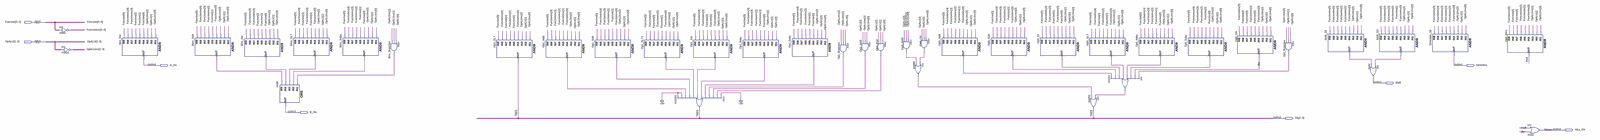
[diagram p0: schematic sheet, whole]
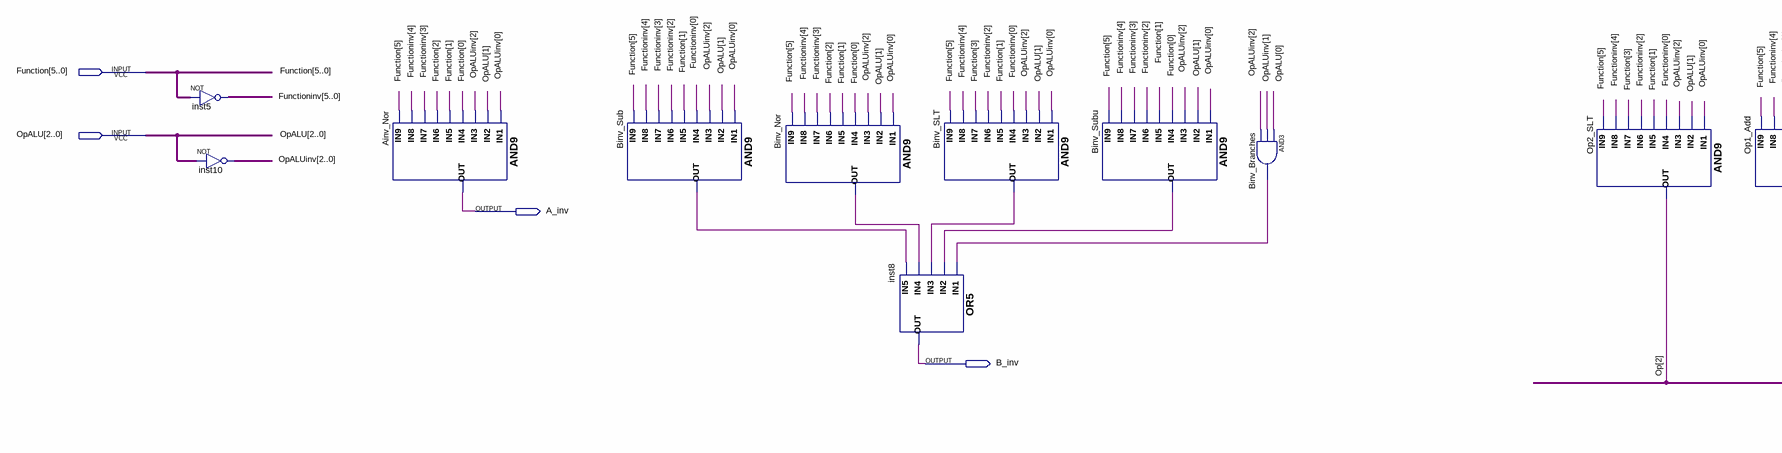
[diagram p1: schematic sheet, left part]
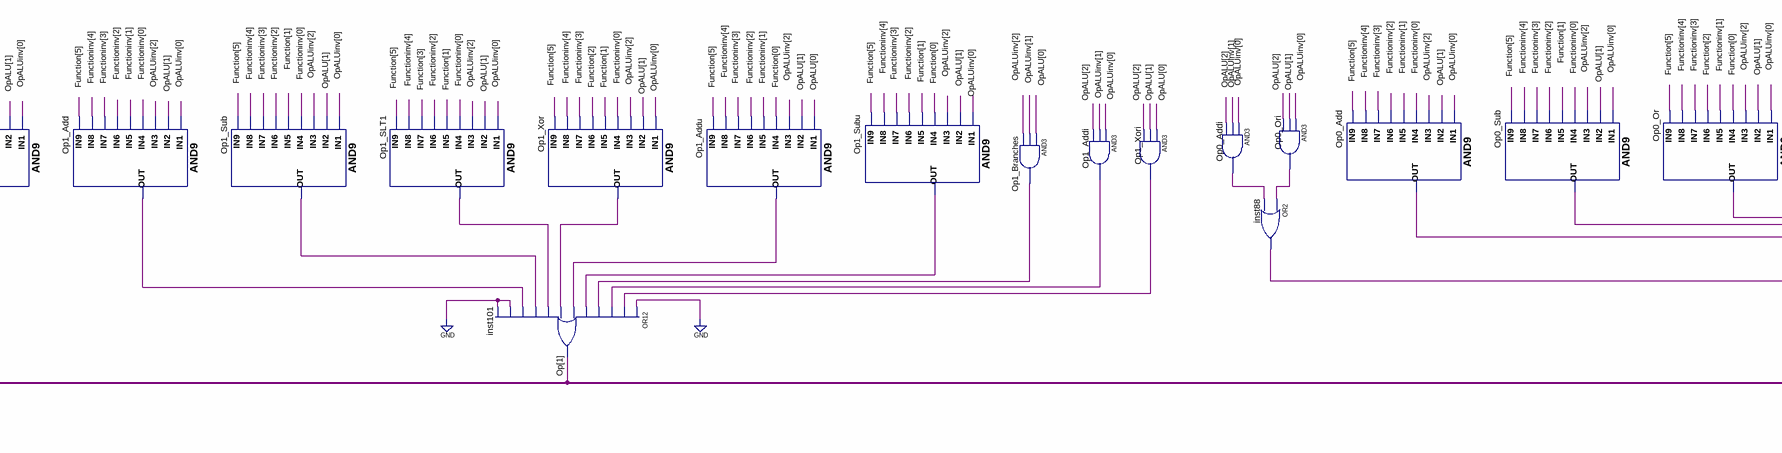
[diagram p2: schematic sheet, centre part]
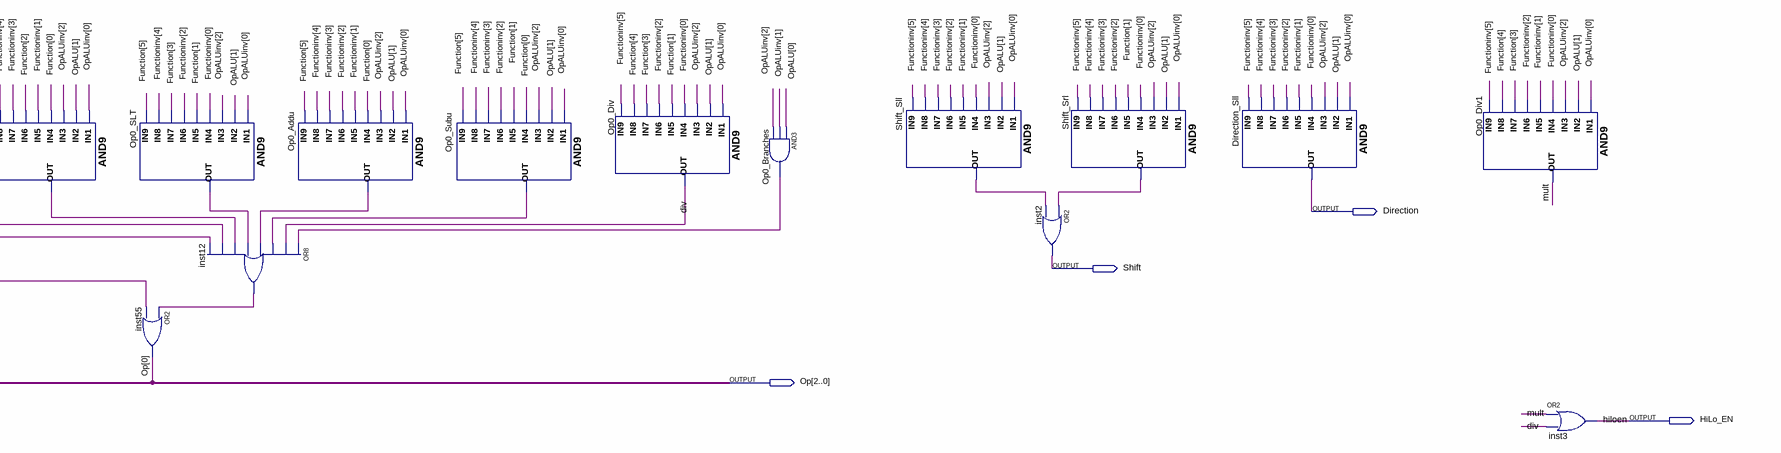
[diagram p3: schematic sheet, right part]
// Quartus schematic Controlador_ULA.bdf as structural Verilog: 39 symbols, 8 pins
module Controlador_ULA (
  input  [5:0] Function,
  input  [2:0] OpALU,
  output A_inv,
  output Direction,
  output Shift,
  output B_inv,
  output [2:0] Op,
  output HiLo_EN
);

  wire Binv_Branches_out, Binv_Nor_out, Binv_SLT_out, Binv_Sub_out, Binv_Subu_out, div, inst12_out,
       inst88_out, mult, Op0_Add_out, Op0_Addi_out, Op0_Addu_out, Op0_Branches_out, Op0_Or_out, Op0_Ori_out,
       Op0_SLT_out, Op0_Sub_out, Op0_Subu_out, Op1_Add_out, Op1_Addi_out, Op1_Addu_out, Op1_Branches_out,
       Op1_SLT1_out, Op1_Sub_out, Op1_Subu_out, Op1_Xor_out, Op1_Xori_out, Shift_Sll_out, Shift_Srl_out;
  wire [2:0] OpALUinv;
  wire [5:0] Functioninv;

  assign Functioninv = ~Function;  // NOT inst5, 6 bits wide
  assign OpALUinv = ~OpALU;  // NOT inst10, 3 bits wide
  and Ainv_Nor (A_inv, OpALUinv[0], OpALU[1], OpALUinv[2], Function[0], Function[1], Function[2], Functioninv[3], Functioninv[4], Function[5]);
  and Binv_Sub (Binv_Sub_out, OpALUinv[0], OpALU[1], OpALUinv[2], Functioninv[0], Function[1], Functioninv[2], Functioninv[3], Functioninv[4], Function[5]);
  and Binv_Nor (Binv_Nor_out, OpALUinv[0], OpALU[1], OpALUinv[2], Function[0], Function[1], Function[2], Functioninv[3], Functioninv[4], Function[5]);
  or inst8 (B_inv, Binv_Branches_out, Binv_Subu_out, Binv_SLT_out, Binv_Nor_out, Binv_Sub_out);
  and Binv_SLT (Binv_SLT_out, OpALUinv[0], OpALU[1], OpALUinv[2], Functioninv[0], Function[1], Functioninv[2], Function[3], Functioninv[4], Function[5]);
  and Binv_Subu (Binv_Subu_out, OpALUinv[0], OpALU[1], OpALUinv[2], Function[0], Function[1], Functioninv[2], Functioninv[3], Functioninv[4], Function[5]);
  and Binv_Branches (Binv_Branches_out, OpALU[0], OpALUinv[1], OpALUinv[2]);
  and Op2_SLT (Op[2], OpALUinv[0], OpALU[1], OpALUinv[2], Functioninv[0], Function[1], Functioninv[2], Function[3], Functioninv[4], Function[5]);
  and Op1_Add (Op1_Add_out, OpALUinv[0], OpALU[1], OpALUinv[2], Functioninv[0], Functioninv[1], Functioninv[2], Functioninv[3], Functioninv[4], Function[5]);
  and Op1_Sub (Op1_Sub_out, OpALUinv[0], OpALU[1], OpALUinv[2], Functioninv[0], Function[1], Functioninv[2], Functioninv[3], Functioninv[4], Function[5]);
  and Op1_SLT1 (Op1_SLT1_out, OpALUinv[0], OpALU[1], OpALUinv[2], Functioninv[0], Function[1], Functioninv[2], Function[3], Functioninv[4], Function[5]);
  or inst101 (Op[1], 1'b0, Op1_Xori_out, Op1_Addi_out, Op1_Branches_out, Op1_Subu_out, Op1_Addu_out, Op1_Xor_out, Op1_SLT1_out, Op1_Sub_out, Op1_Add_out, 1'b0, 1'b0);
  and Op1_Xor (Op1_Xor_out, OpALUinv[0], OpALU[1], OpALUinv[2], Functioninv[0], Function[1], Function[2], Functioninv[3], Functioninv[4], Function[5]);
  and Op1_Addu (Op1_Addu_out, OpALU[0], OpALU[1], OpALUinv[2], Function[0], Functioninv[1], Functioninv[2], Functioninv[3], Functioninv[4], Function[5]);
  and Op1_Subu (Op1_Subu_out, OpALUinv[0], OpALU[1], OpALUinv[2], Function[0], Function[1], Functioninv[2], Functioninv[3], Functioninv[4], Function[5]);
  and Op1_Branches (Op1_Branches_out, OpALU[0], OpALUinv[1], OpALUinv[2]);
  and Op1_Addi (Op1_Addi_out, OpALUinv[0], OpALUinv[1], OpALU[2]);
  and Op1_Xori (Op1_Xori_out, OpALU[0], OpALU[1], OpALU[2]);
  and Op0_Addi (Op0_Addi_out, OpALUinv[0], OpALUinv[1], OpALU[2]);
  or inst88 (inst88_out, Op0_Ori_out, Op0_Addi_out);
  and Op0_Ori (Op0_Ori_out, OpALUinv[0], OpALU[1], OpALU[2]);
  and Op0_Add (Op0_Add_out, OpALUinv[0], OpALU[1], OpALUinv[2], Functioninv[0], Functioninv[1], Functioninv[2], Functioninv[3], Functioninv[4], Function[5]);
  and Op0_Sub (Op0_Sub_out, OpALUinv[0], OpALU[1], OpALUinv[2], Functioninv[0], Function[1], Functioninv[2], Functioninv[3], Functioninv[4], Function[5]);
  and Op0_Or (Op0_Or_out, OpALUinv[0], OpALU[1], OpALUinv[2], Function[0], Functioninv[1], Function[2], Functioninv[3], Functioninv[4], Function[5]);
  and Op0_SLT (Op0_SLT_out, OpALUinv[0], OpALU[1], OpALUinv[2], Functioninv[0], Function[1], Functioninv[2], Function[3], Functioninv[4], Function[5]);
  or inst55 (Op[0], inst12_out, inst88_out);
  or inst12 (inst12_out, Op0_Branches_out, div, Op0_Subu_out, Op0_Addu_out, Op0_SLT_out, Op0_Or_out, Op0_Sub_out, Op0_Add_out);
  and Op0_Addu (Op0_Addu_out, OpALUinv[0], OpALU[1], OpALUinv[2], Function[0], Functioninv[1], Functioninv[2], Functioninv[3], Functioninv[4], Function[5]);
  and Op0_Subu (Op0_Subu_out, OpALUinv[0], OpALU[1], OpALUinv[2], Function[0], Function[1], Functioninv[2], Functioninv[3], Functioninv[4], Function[5]);
  and Op0_Div (div, OpALUinv[0], OpALU[1], OpALUinv[2], Functioninv[0], Function[1], Functioninv[2], Function[3], Function[4], Functioninv[5]);
  and Op0_Branches (Op0_Branches_out, OpALU[0], OpALUinv[1], OpALUinv[2]);
  and Shift_Sll (Shift_Sll_out, OpALUinv[0], OpALU[1], OpALUinv[2], Functioninv[0], Functioninv[1], Functioninv[2], Functioninv[3], Functioninv[4], Functioninv[5]);
  or inst2 (Shift, Shift_Srl_out, Shift_Sll_out);
  and Shift_Srl (Shift_Srl_out, OpALUinv[0], OpALU[1], OpALUinv[2], Functioninv[0], Function[1], Functioninv[2], Functioninv[3], Functioninv[4], Functioninv[5]);
  and Direction_Sll (Direction, OpALUinv[0], OpALU[1], OpALUinv[2], Functioninv[0], Functioninv[1], Functioninv[2], Functioninv[3], Functioninv[4], Functioninv[5]);
  and Op0_Div1 (mult, OpALUinv[0], OpALU[1], OpALUinv[2], Functioninv[0], Functioninv[1], Functioninv[2], Function[3], Function[4], Functioninv[5]);
  or inst3 (HiLo_EN, mult, div);

  // Other names for the same wires on the sheet: hiloen = HiLo_EN
endmodule
